# EAGLE design PIC18+Peripheral_breakout_LRbuttons (EAGLE 7.7.0)
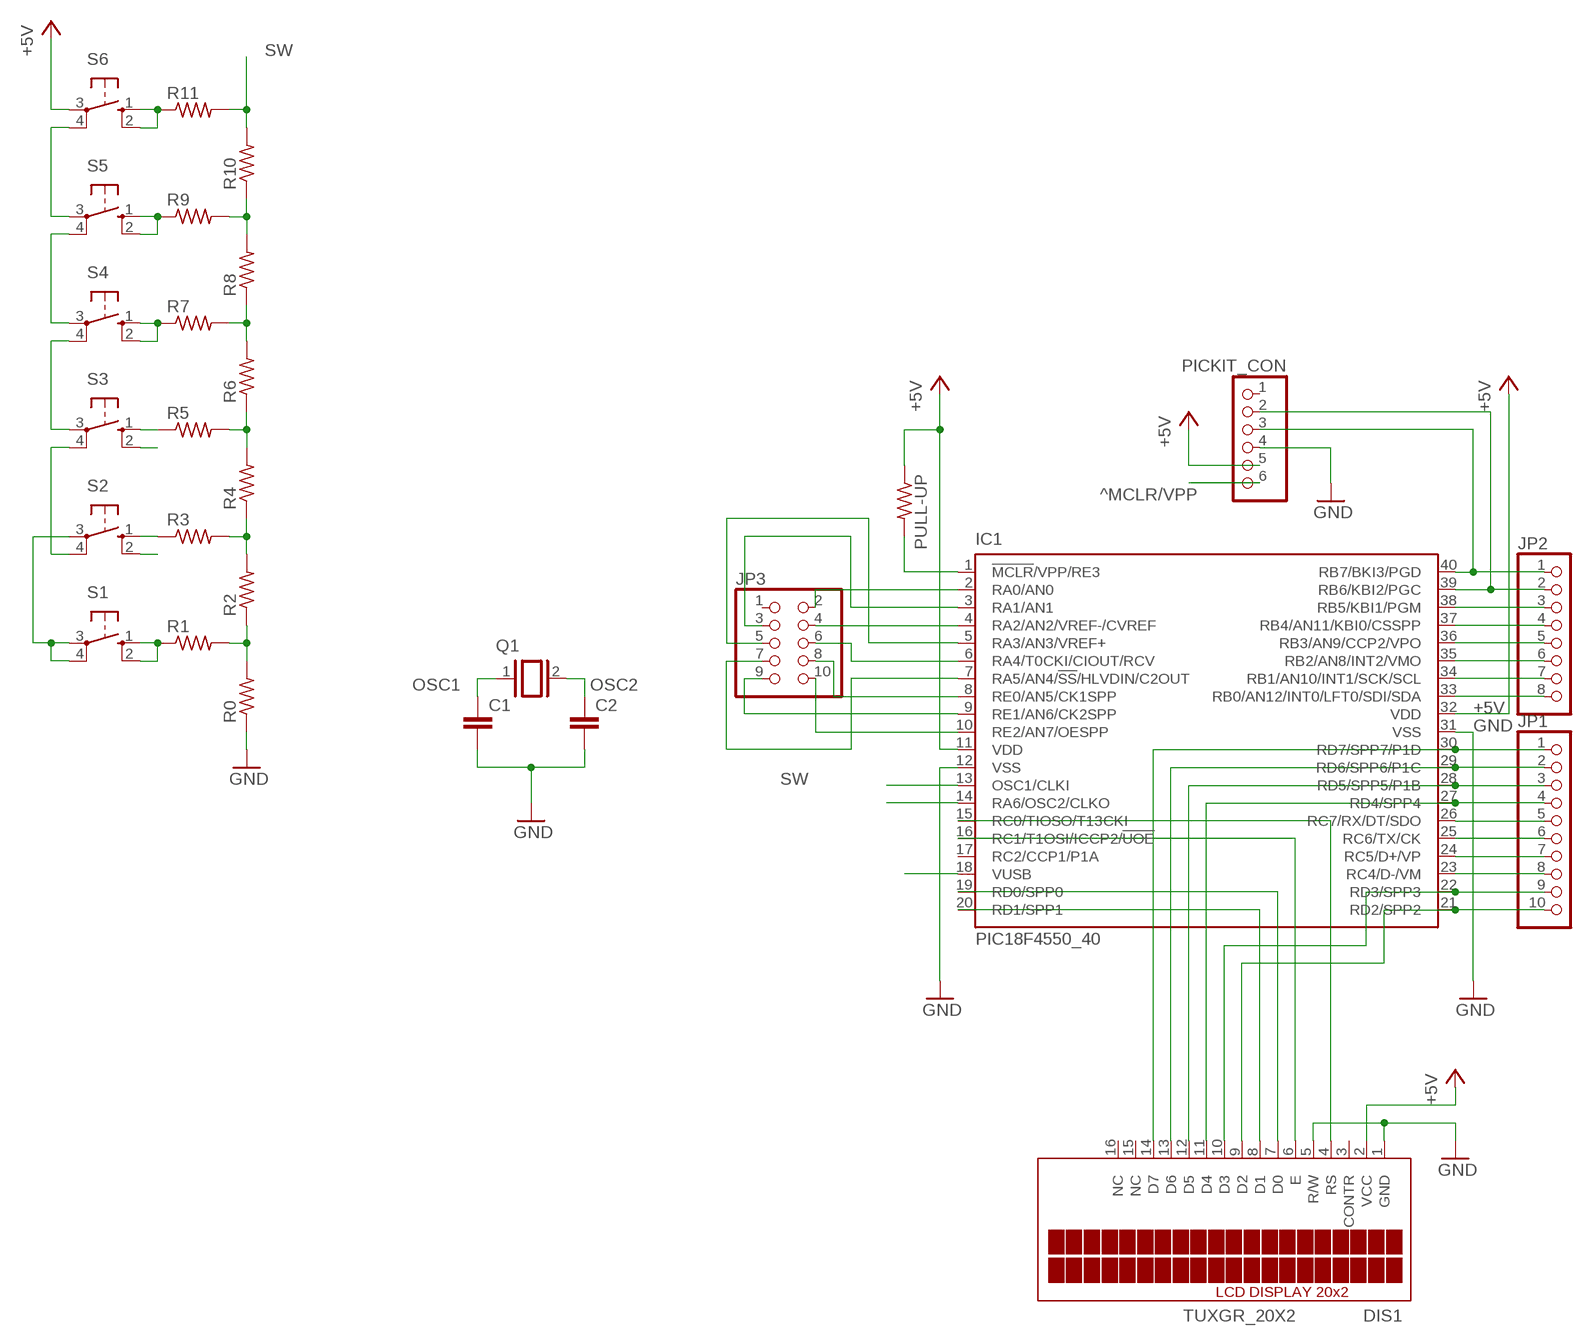
[diagram p0: schematic, sheet 1]

## Parts
C1  C-EUC1206  [C1206]
C2  C-EUC1206  [C1206]
DIS1  TUXGR_20X2  [TUXGR_20X2]
IC1  PIC18F4550_40  [DIL40]
JP1  PINHD-1X10  [1X10]
JP2  PINHD-1X8  [1X08]
JP3  PINHD-2X5  [2X05]
PICKIT_CON  PINHD-1X6/90  [1X06/90]
PULL-UP  R-US_R1206  [R1206]
Q1  XTAL/S  [QS]
R0  R-US_R1206  [R1206]
R1  R-US_R1206  [R1206]
R2  R-US_R1206  [R1206]
R3  R-US_R1206  [R1206]
R4  R-US_R1206  [R1206]
R5  R-US_R1206  [R1206]
R6  R-US_R1206  [R1206]
R7  R-US_R1206  [R1206]
R8  R-US_R1206  [R1206]
R9  R-US_R1206  [R1206]
R10  R-US_R1206  [R1206]
R11  R-US_R1206  [R1206]
S1  10-XX  [B3F-10XX]
S2  10-XX  [B3F-10XX]
S3  10-XX  [B3F-10XX]
S4  10-XX  [B3F-10XX]
S5  10-XX  [B3F-10XX]
S6  10-XX  [B3F-10XX]

## Nets
+5V: DIS1.2(VCC) IC1.11(VDD) IC1.32(VDD) PICKIT_CON.5 PULL-UP.1 S6.3(P)
^MCLR/VPP: IC1.1(!MCLR!/VPP/RE3) PICKIT_CON.6 PULL-UP.2
D0: DIS1.7(D0) IC1.19(RD0/SPP0)
D1: DIS1.8(D1) IC1.20(RD1/SPP1)
D2: DIS1.9(D2) IC1.21(RD2/SPP2) JP1.10
D3: DIS1.10(D3) IC1.22(RD3/SPP3) JP1.9
D4: DIS1.11(D4) IC1.27(RD4/SPP4) JP1.4
D5: DIS1.12(D5) IC1.28(RD5/SPP5/P1B) JP1.3
D6: DIS1.13(D6) IC1.29(RD6/SPP6/P1C) JP1.2
D7: DIS1.14(D7) IC1.30(RD7/SPP7/P1D) JP1.1
E: DIS1.6(E) IC1.16(RC1/T1OSI/ICCP2/!UOE)
GND: C1.2 C2.2 DIS1.1(GND) DIS1.5(R/W) IC1.12(VSS) IC1.31(VSS) PICKIT_CON.4 R0.1
N$1: IC1.18(VUSB)
N$2: IC1.26(RC7/RX/DT/SDO) JP1.5
N$3: IC1.25(RC6/TX/CK) JP1.6
N$4: IC1.24(RC5/D+/VP) JP1.7
N$5: IC1.23(RC4/D-/VM) JP1.8
N$6: IC1.38(RB5/KBI1/PGM) JP2.3
N$7: IC1.37(RB4/AN11/KBI0/CSSPP) JP2.4
N$8: IC1.36(RB3/AN9/CCP2/VPO) JP2.5
N$9: IC1.35(RB2/AN8/INT2/VMO) JP2.6
N$10: IC1.34(RB1/AN10/INT1/SCK/SCL) JP2.7
N$11: IC1.33(RB0/AN12/INT0/LFT0/SDI/SDA) JP2.8
N$12: IC1.2(RA0/AN0) JP3.2
N$13: IC1.3(RA1/AN1) JP3.3
N$14: IC1.4(RA2/AN2/VREF-/CVREF) JP3.4
N$15: IC1.5(RA3/AN3/VREF+) JP3.5
N$16: IC1.6(RA4/T0CKI/CIOUT/RCV) JP3.6
N$17: IC1.8(RE0/AN5/CK1SPP) JP3.8
N$18: R0.2 R1.2 R2.1
N$19: IC1.9(RE1/AN6/CK2SPP) JP3.9
N$20: IC1.7(RA5/AN4/!SS!/HLVDIN/C2OUT) JP3.7
N$21: R1.1 S1.1(S) S1.2(S1)
N$22: R2.2 R3.2 R4.1
N$23: R3.1 S2.1(S)
N$24: R5.1 S3.1(S)
N$25: R7.1 S4.1(S) S4.2(S1)
N$26: R4.2 R5.2 R6.1
N$27: R6.2 R7.2 R8.1
N$28: R8.2 R9.2 R10.1
N$29: S1.3(P) S1.4(P1) S2.3(P)
N$30: R11.1 S6.1(S) S6.2(S1)
N$31: R9.1 S5.1(S) S5.2(S1)
N$32: S2.2(S1)
N$33: S2.4(P1) S3.4(P1)
N$34: S3.3(P) S4.4(P1)
N$35: S4.3(P) S5.4(P1)
N$36: S5.3(P) S6.4(P1)
N$37: S3.2(S1)
OSC1: C1.1 IC1.13(OSC1/CLKI) Q1.1
OSC2: C2.1 IC1.14(RA6/OSC2/CLKO) Q1.2
PGC: IC1.39(RB6/KBI2/PGC) JP2.2 PICKIT_CON.2
PGD: IC1.40(RB7/BKI3/PGD) JP2.1 PICKIT_CON.3
RS: DIS1.4(RS) IC1.15(RC0/TIOSO/T13CKI)
SW: IC1.10(RE2/AN7/OESPP) JP3.10 R10.2 R11.2
Unconnected: DIS1.3(CONTR) DIS1.15(NC) DIS1.16(NC) IC1.17(RC2/CCP1/P1A) JP3.1 PICKIT_CON.1

## Library data of the parts
C1 C2 = resistor:C-EU: CAPACITOR, European symbol
DIS1 = display-lcd:TUXGR_20X2: Tuxgraphics LCD display 20x2 characters reflective, without background light Source: tuxgr_20x2.pdf; OC_FARNELL: unknown; OC_NEWARK: unknown
IC1 = microchip:PIC18F4*_40: USB Microcontrollers with nanoWatt Technology High-Performance, Enhanced Flash, 28/40/44-Pin, Source: http://ww1.microchip.com/downloads/en/devicedoc/39632c.pdf; MF: MICROCHIP; MPN: PIC18F4550-I/P; OC_FARNELL: 9321357; OC_NEWARK: 74K8623
JP1 = pinhead:PINHD-1X10: PIN HEADER
JP2 = pinhead:PINHD-1X8: PIN HEADER
JP3 = pinhead:PINHD-2X5: PIN HEADER
PICKIT_CON = pinhead:PINHD-1X6: PIN HEADER
PULL-UP R0 R1-R11 = rcl:R-US_: RESISTOR, American symbol
Q1 = special:XTAL/S: CRYSTAL
S1-S6 = switch-omron:10-XX: OMRON SWITCH; MPN: B3F-1000; OC_FARNELL: 176432; OC_NEWARK: 36M3542

## Board
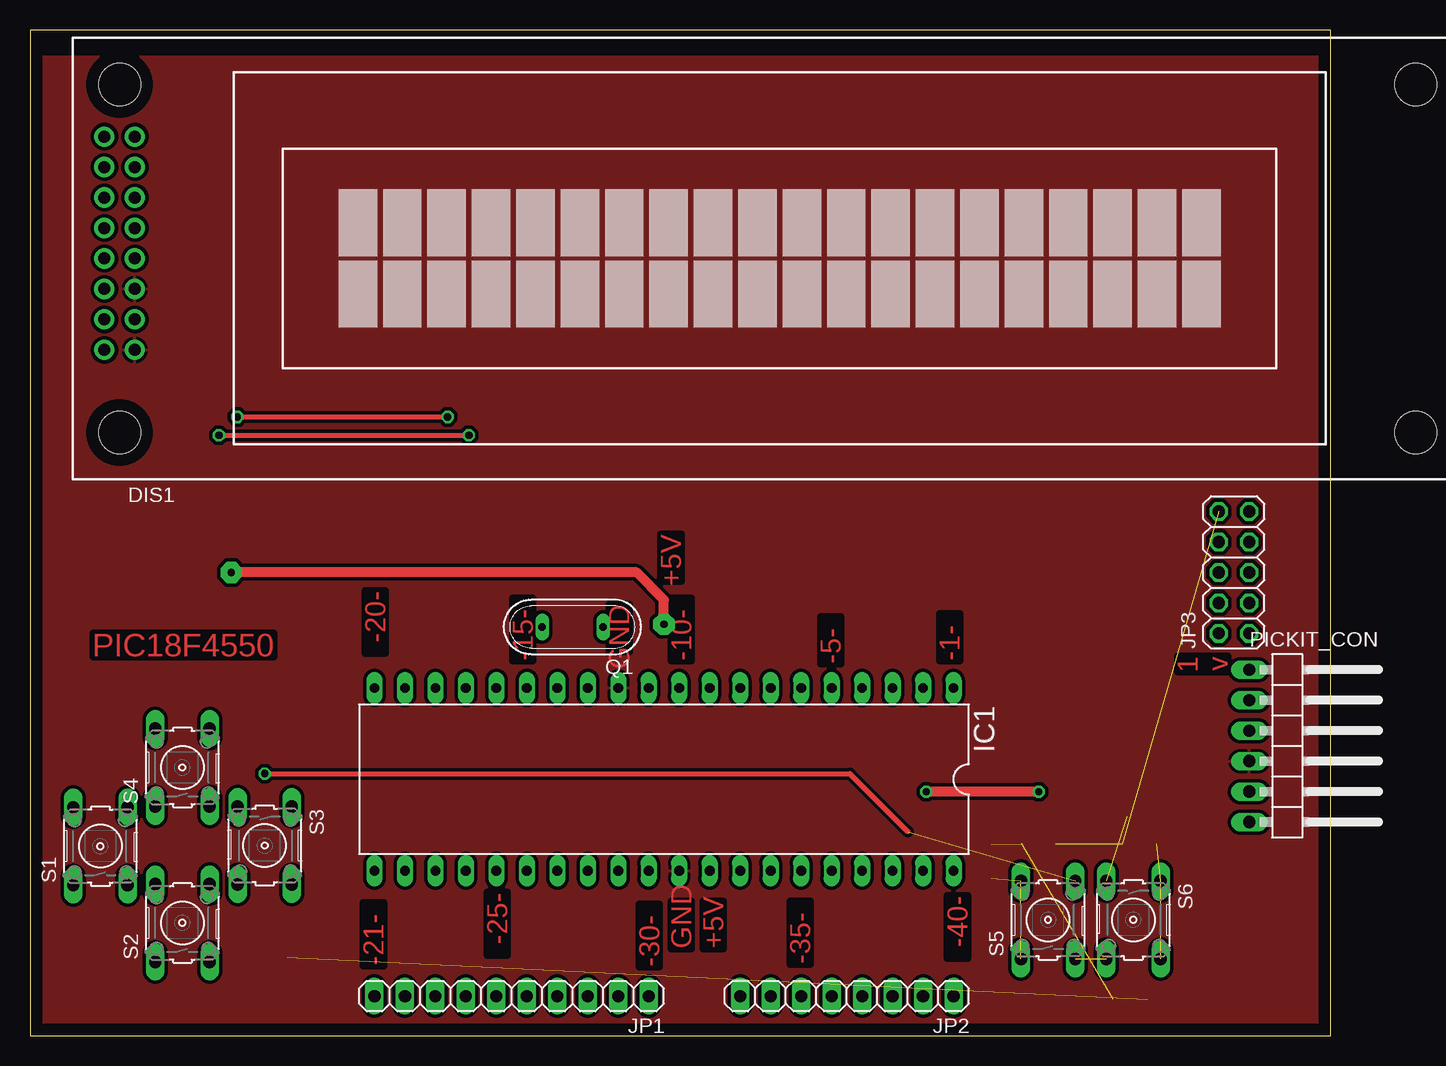
[diagram p1: board, top side]
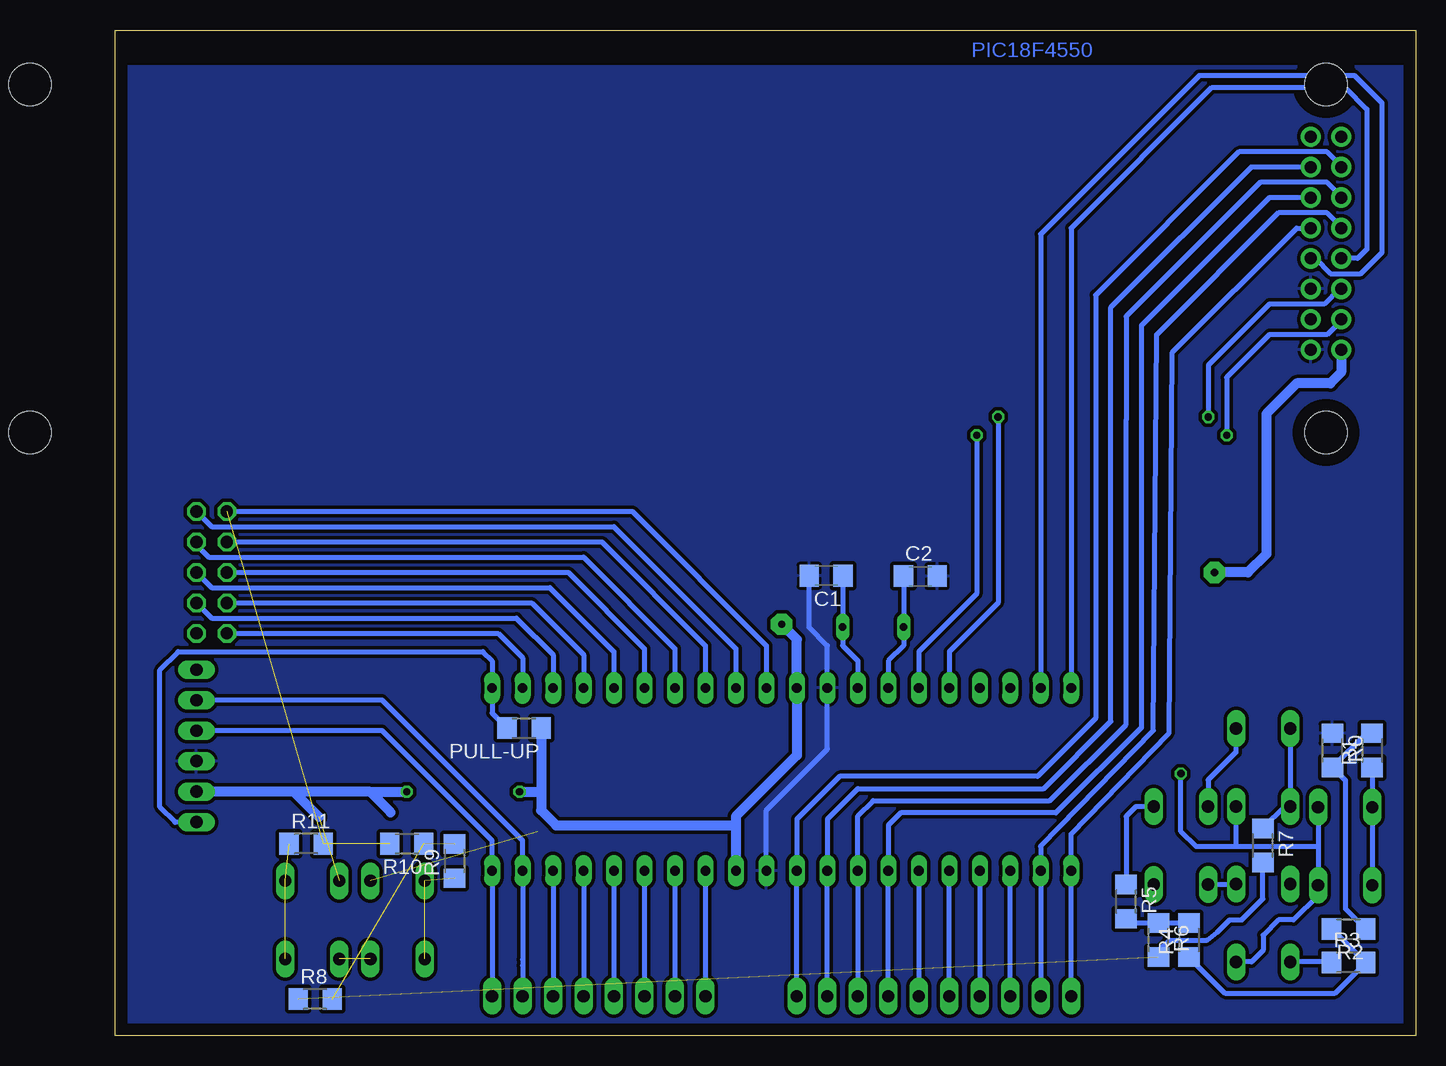
[diagram p2: board, bottom side, seen from below]

Size 108.38 x 83.81 mm. Coordinates in mm from the lower left corner, seen from the top.
Outline: 0,0 108.38,0 108.38,83.81 0,83.81 0,0
Copper layers (1*16): Top 0.035mm / dielectric 1.5mm / Bottom 0.035mm
Design rules "default": minimum track width 10mil, minimum drill 24mil, track to track 8mil, track to pad 8mil, pad to pad 8mil, via to via 8mil, smd to smd 8mil, copper to edge 40mil, drill to drill 8mil, minimum pad ring 10mil, minimum via ring 8mil, stop-mask expansion 4mil, vias tented up to drill 0mil, thermal gap 10mil

### Footprints (pad centres in the part's own frame; a part is rotated, then mirrored left to right if it is on the bottom)
C1206 = smd 1.6 x 1.8: 1 -1.4,0; 2 1.4,0
TUXGR_20X2 = drill 1 pad 1.676: 1 -52.73,-7.62; 2 -55.27,-7.62; 3 -52.73,-5.08; 4 -55.27,-5.08; 5 -52.73,-2.54; 6 -55.27,-2.54; 7 -52.73,0; 8 -55.27,0; 9 -52.73,2.54; 10 -55.27,2.54; 11 -52.73,5.08; 12 -55.27,5.08; 13 -52.73,7.62; 14 -55.27,7.62; 15 -52.73,10.16; 16 -55.27,10.16 | hole 3.5: -54,-14.5; 54,-14.5; -54,14.5; 54,14.5
DIL40 = drill 0.813 long: 1 -24.13,-7.62; 2 -21.59,-7.62; 3 -19.05,-7.62; 4 -16.51,-7.62; 5 -13.97,-7.62; 6 -11.43,-7.62; 7 -8.89,-7.62; 8 -6.35,-7.62; 9 -3.81,-7.62; 10 -1.27,-7.62; 11 1.27,-7.62; 12 3.81,-7.62; 13 6.35,-7.62; 14 8.89,-7.62; 15 11.43,-7.62; 16 13.97,-7.62; 17 16.51,-7.62; 18 19.05,-7.62; 19 21.59,-7.62; 20 24.13,-7.62; 21 24.13,7.62; 22 21.59,7.62; 23 19.05,7.62; 24 16.51,7.62; 25 13.97,7.62; 26 11.43,7.62; 27 8.89,7.62; 28 6.35,7.62; 29 3.81,7.62; 30 1.27,7.62; 31 -1.27,7.62; 32 -3.81,7.62; 33 -6.35,7.62; 34 -8.89,7.62; 35 -11.43,7.62; 36 -13.97,7.62; 37 -16.51,7.62; 38 -19.05,7.62; 39 -21.59,7.62; 40 -24.13,7.62
1X10 = drill 1.016 long: 1 -11.43,0; 2 -8.89,0; 3 -6.35,0; 4 -3.81,0; 5 -1.27,0; 6 1.27,0; 7 3.81,0; 8 6.35,0; 9 8.89,0; 10 11.43,0
1X08 = drill 1.016 long: 1 -8.89,0; 2 -6.35,0; 3 -3.81,0; 4 -1.27,0; 5 1.27,0; 6 3.81,0; 7 6.35,0; 8 8.89,0
2X05 = drill 1.016 octagon: 1 -5.08,-1.27; 2 -5.08,1.27; 3 -2.54,-1.27; 4 -2.54,1.27; 5 0,-1.27; 6 0,1.27; 7 2.54,-1.27; 8 2.54,1.27; 9 5.08,-1.27; 10 5.08,1.27
1X06/90 = drill 1.016 long: 1 -6.35,-3.81; 2 -3.81,-3.81; 3 -1.27,-3.81; 4 1.27,-3.81; 5 3.81,-3.81; 6 6.35,-3.81
R1206 = smd 1.6 x 1.803: 1 -1.422,0; 2 1.422,0
QS = drill 0.61 long: 1 -2.54,0; 2 2.54,0
B3F-10XX = drill 1.016 long: 1 -3.251,2.261; 2 3.251,2.261; 3 -3.251,-2.261; 4 3.251,-2.261

### Placement (x,y rotation side)
C1  49.12,38.33 180 bottom
C2  41.27,38.3 0 bottom
DIS1  61.47,64.77 0 top
IC1  52.83,21.36 180 top
JP1  40.13,3.3 180 top
JP2  68.07,3.3 180 top
JP3  100.33,38.61 90 top
PICKIT_CON  105.41,24.16 270 top
PULL-UP  74.3,25.63 180 bottom
Q1  45.21,34.06 180 top
R0  6.93,23.77 270 bottom
R1  3.63,23.77 90 bottom
R2  5.59,8.89 180 bottom
R3  5.59,6.1 0 bottom
R4  18.9,7.98 90 bottom
R5  24.13,11.18 270 bottom
R6  21.44,7.98 270 bottom
R7  12.73,15.85 270 bottom
R8  91.69,3.05 0 bottom
R9  80.09,14.55 90 bottom
R10  84.07,16 180 bottom
R11  92.46,16 0 bottom
S1  5.87,15.8 90 top
S2  12.7,9.4 90 top
S3  19.56,15.85 270 top
S4  12.7,22.35 90 top
S5  84.84,9.65 90 top
S6  91.95,9.65 270 top

### Tracks (layer width: path | path; a pad name or v marks a point on that pad's centre or on a via)
+5V  (via drill 0.6, 0.6 pad 1.78)  (1 unrouted)
  Top 0.813: v52.83,34.29 52.83,36.32 50.55,38.61 v16.76,38.61 | v84.07,20.32 v74.68,20.32
  Bottom 0.406: 56.9,17.53 56.64,17.27 | 101.58,20.32 PICKIT_CON.5
  Bottom 0.813: v52.83,34.29 51.56,33.02 IC1.11 51.56,23.37 56.64,18.29 56.64,17.27 IC1.32 | DIS1.2 6.2,55.27 7.11,54.36 9.91,54.36 12.45,51.82 12.45,40.13 13.97,38.61 v16.76,38.61 | PULL-UP.1 72.87,20.32 | 72.87,20.32 72.87,18.77 71.63,17.53 56.9,17.53 | 91.39,18.24 93.47,20.32 | 93.47,20.32 101.58,20.32 | 87.12,20.32 93.47,20.32 | 85.42,18.62 87.12,20.32 | 87.12,20.32 v84.07,20.32 | v74.68,20.32 72.87,20.32
^MCLR/VPP
  Bottom 0.406: PICKIT_CON.6 101.62,17.78 103.38,17.78 104.65,19.05 104.65,30.48 103.12,32 77.72,32 76.96,31.24 IC1.1 76.96,26.87 PULL-UP.2
D0
  Bottom 0.406: DIS1.7 8.38,64.77 7.11,63.5 4.57,63.5 2.79,65.28 2.79,77.72 5.08,80.01 18.03,80.01 31.24,66.8 IC1.19
D1
  Bottom 0.406: DIS1.8 4.83,64.77 4.06,65.53 4.06,77.22 5.84,78.99 17.02,78.99 28.7,67.31 IC1.20
D2
  Bottom 0.406: DIS1.9 9.91,67.31 20.32,56.9 20.57,25.17 28.7,16.79 IC1.21 JP1.10
D3
  Bottom 0.406: DIS1.10 6.1,67.31 7.37,68.58 11.43,68.58 21.59,58.42 21.84,25.43 31.24,15.77 IC1.22 JP1.9
D4
  Bottom 0.406: DIS1.11 12.19,69.85 22.86,59.18 22.86,51.05 22.86,50.55 22.86,25.68 29.97,18.57 42.93,18.57 43.94,17.55 IC1.27 JP1.4
D5
  Bottom 0.406: DIS1.12 6.1,69.85 7.37,71.12 12.95,71.12 24.13,59.94 24.13,51.31 24.13,51.05 24.13,25.93 30.48,19.58 45.21,19.58 46.48,18.31 IC1.28 JP1.3
D6
  Bottom 0.406: DIS1.13 13.72,72.39 25.4,60.71 25.4,26.19 30.99,20.6 46.48,20.6 49.02,18.06 IC1.29 JP1.2
D7
  Bottom 0.406: DIS1.14 6.1,72.39 7.37,73.66 14.73,73.66 26.67,61.72 26.67,26.44 31.5,21.61 48.01,21.61 51.56,18.06 IC1.30 JP1.1
E  (via drill 0.6)
  Top 0.406: v17.27,51.56 v34.8,51.56
  Bottom 0.406: DIS1.6 6.35,62.23 7.62,60.96 12.19,60.96 17.27,55.88 v17.27,51.56 | v34.8,51.56 34.8,36.07 38.86,32 IC1.16
GND
  Bottom 0.406: IC1.31 54.1,18.8 49.02,23.88 IC1.12 49.02,32.51 50.55,34.04 50.55,38.31 C1.2
  pour Bottom (isolate 0.305): 0,80.77 0,0 108.2,0 108.2,80.77
  pour Top (isolate 0.305): -0.76,81.53 -0.76,0.76 107.44,0.76 107.44,81.53
N$2
  Bottom 0.406: IC1.26 JP1.5
N$3
  Bottom 0.406: JP1.6 IC1.25
N$4
  Bottom 0.406: IC1.24 JP1.7
N$5
  Bottom 0.406: JP1.8 IC1.23
N$6
  Bottom 0.406: IC1.38 JP2.3
N$7
  Bottom 0.406: IC1.37 JP2.4
N$8
  Bottom 0.406: IC1.36 JP2.5
N$9
  Bottom 0.406: IC1.35 JP2.6
N$10
  Bottom 0.406: IC1.34 JP2.7
N$11
  Bottom 0.406: IC1.33 JP2.8
N$12
  Bottom 0.406: JP3.2 76.45,33.53 74.42,31.5 IC1.2
N$13
  Bottom 0.406: JP3.3 100.33,34.8 74.93,34.8 71.88,31.75 IC1.3
N$14
  Bottom 0.406: JP3.4 73.66,36.07 69.34,31.75 IC1.4
N$15
  Bottom 0.406: JP3.5 100.33,37.34 72.14,37.34 66.8,32 IC1.5
N$16
  Bottom 0.406: JP3.6 70.61,38.61 64.26,32.26 IC1.6
N$17
  Bottom 0.406: JP3.8 67.82,41.15 59.18,32.51 IC1.8
N$18
  Bottom 0.406: R2.1 5.84,10.57 5.84,21.26 R0.2 4.09,25.2 R1.2
N$19
  Bottom 0.406: JP3.9 100.33,42.42 66.8,42.42 56.64,32.26 IC1.9
N$20
  Bottom 0.406: JP3.7 101.6,40.89 100.58,39.88 69.34,39.88 61.72,32.26 IC1.7
N$21
  Bottom 0.406: R1.1 3.63,19.07 S1.2 S1.1
N$22
  Bottom 0.406: R2.2 6.96,8.89 R3.2 6.71,3.56 15.9,3.56 R4.1
N$23
  Bottom 0.406: R3.1 7.06,6.15 S2.1
N$24
  Bottom 0.406: S3.1 23.32,19.1 24.13,18.29 R5.1
N$25
  Bottom 0.406: R7.1 10.9,19.1 S4.1 S4.2
N$26
  Bottom 0.406: R4.2 R6.1 23.77,9.4 R5.2
N$27  (1 unrouted)
  Bottom 0.406: R6.2 21.44,7.06 20.52,7.98 17.37,7.98 16.51,8.64 15.49,9.65 14.48,9.65 12.72,11.4 R7.2
N$28  (2 unrouted)
N$29
  Bottom 0.406: S1.4 S1.3 8.13,11.68 10.16,9.65 11.43,9.65 12.7,8.38 12.7,7.11 13.66,6.15 S2.3
N$30  (2 unrouted)
N$31  (2 unrouted)
N$33
  Bottom 0.406: S2.4 15.01,12.6 S3.4
N$34
  Bottom 0.406: S4.4 14.99,25.58 14.99,23.62 17.3,21.31 S3.3
N$35  (via drill 0.6)  (1 unrouted)
  Top 0.406: v19.56,21.84 68.33,21.84 73.15,17.02
  Bottom 0.406: 14.96,15.75 S4.3 | 8.13,15.75 14.96,15.75 | 14.96,15.75 18.29,15.75 19.56,17.02 v19.56,21.84
N$36  (1 unrouted)
OSC1
  Bottom 0.406: IC1.13 46.48,31.24 47.75,32.51 Q1.1 47.72,34.09 C1.1
OSC2
  Bottom 0.406: IC1.14 43.94,31.24 42.67,32.51 Q1.2 C2.1
PGC
  Bottom 0.406: JP2.2 74.42,5.84 74.42,6.35 IC1.39 74.42,16.26 86.13,27.96 PICKIT_CON.2
PGD
  Bottom 0.406: JP2.1 IC1.40 76.96,16.26 86.13,25.43 PICKIT_CON.3
RS  (via drill 0.6)
  Top 0.406: v15.75,50.04 v36.58,50.04
  Bottom 0.406: DIS1.4 6.2,59.59 7.37,58.42 12.19,58.42 15.75,54.86 v15.75,50.04 | v36.58,50.04 36.58,36.83 41.4,32 IC1.15
SW  (2 unrouted)
  Bottom 0.406: JP3.10 65.28,43.69 54.1,32.51 IC1.10

### Text on the board
Top: +5V | -20- | GND | PIC18F4550 | 1 / v | -15- | -10- | -5- | -1- | -25- | -40- | GND | +5V | -21- | -30- | -35-
Bottom: PIC18F4550